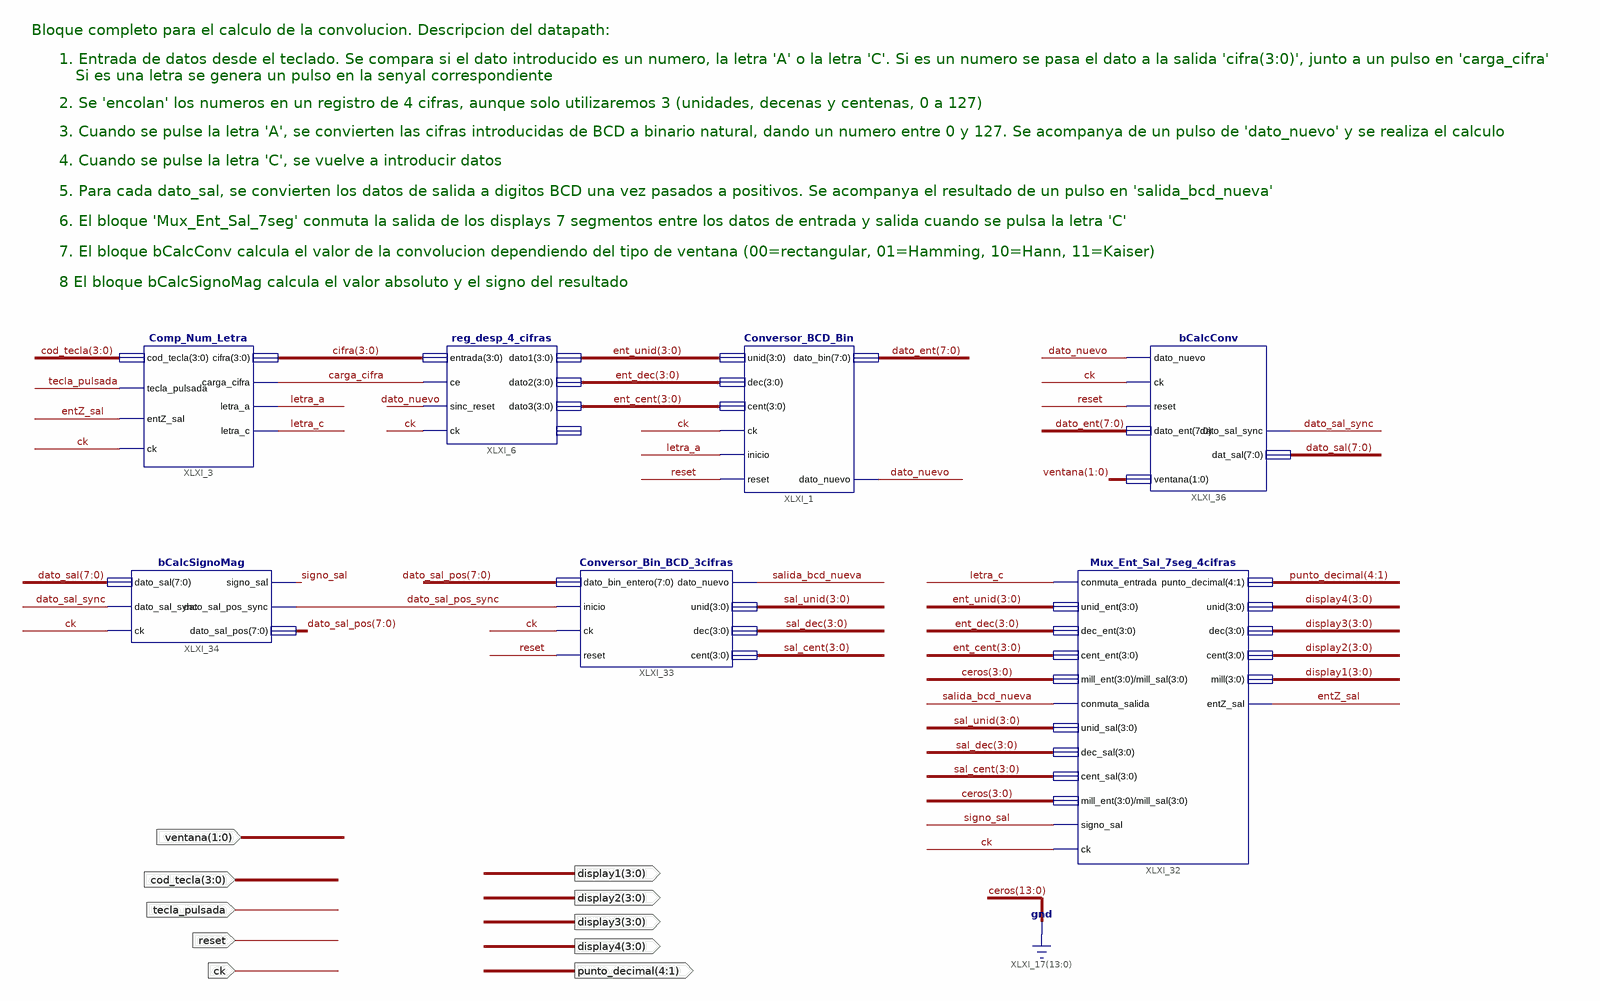
[diagram p0: schematic sheet 1]
// Xilinx ISE schematic bloque_convol.sch (spartan6) as structural Verilog: 7 symbols, 10 ports
module bloque_convol (
  input  ck,
  input  [3:0] cod_tecla,
  input  tecla_pulsada,
  input  reset,
  input  [1:0] ventana,
  output [4:1] punto_decimal,
  output [3:0] display1,
  output [3:0] display2,
  output [3:0] display3,
  output [3:0] display4
);

  wire carga_cifra, dato_nuevo, dato_sal_pos_sync, dato_sal_sync, entZ_sal, letra_a, letra_c,
       salida_bcd_nueva, signo_sal;
  wire [3:0] cifra, ent_cent, ent_dec, ent_unid, sal_cent, sal_dec, sal_unid;
  wire [7:0] dato_ent, dato_sal, dato_sal_pos;

  Comp_Num_Letra XLXI_3 (
    .tecla_pulsada(tecla_pulsada), .ck(ck), .cod_tecla(cod_tecla), .entZ_sal(entZ_sal),
    .carga_cifra(carga_cifra), .letra_a(letra_a), .letra_c(letra_c), .cifra(cifra));
  reg_desp_4_cifras XLXI_6 (
    .ck(ck), .ce(carga_cifra), .entrada(cifra), .sinc_reset(dato_nuevo), .dato1(ent_unid), .dato2(ent_dec),
    .dato3(ent_cent));  // open: dato4
  Conversor_BCD_Bin XLXI_1 (
    .unid(ent_unid), .dec(ent_dec), .cent(ent_cent), .ck(ck), .inicio(letra_a), .reset(reset),
    .dato_nuevo(dato_nuevo), .dato_bin(dato_ent));
  Mux_Ent_Sal_7seg_4cifras XLXI_32 (
    .conmuta_salida(salida_bcd_nueva), .cent_ent(ent_cent), .dec_ent(ent_dec), .conmuta_entrada(letra_c),
    .ck(ck), .unid_ent(ent_unid), .mill_ent(4'b0000), .unid_sal(sal_unid), .dec_sal(sal_dec),
    .cent_sal(sal_cent), .mill_sal(4'b0000), .signo_sal(signo_sal), .punto_decimal(punto_decimal),
    .entZ_sal(entZ_sal), .unid(display4), .dec(display3), .cent(display2), .mill(display1));
  Conversor_Bin_BCD_3cifras XLXI_33 (
    .ck(ck), .dato_bin_entero(dato_sal_pos), .inicio(dato_sal_pos_sync), .reset(reset),
    .dato_nuevo(salida_bcd_nueva), .unid(sal_unid), .dec(sal_dec), .cent(sal_cent));
  bCalcSignoMag XLXI_34 (
    .dato_sal(dato_sal), .dato_sal_sync(dato_sal_sync), .ck(ck), .signo_sal(signo_sal),
    .dato_sal_pos_sync(dato_sal_pos_sync), .dato_sal_pos(dato_sal_pos));
  bCalcConv XLXI_36 (
    .dato_nuevo(dato_nuevo), .ck(ck), .reset(reset), .dato_ent(dato_ent), .ventana(ventana),
    .dat_sal(dato_sal), .dato_sal_sync(dato_sal_sync));

  // Notes on the sheet:
  //   Bloque completo para el calculo de la convolucion. Descripcion del datapath:
  //   1. Entrada de datos desde el teclado. Se compara si el dato introducido es un numero, la letra 'A' o la letra 'C'. Si es un numero se pasa el dato a la salida 'cifra(3:0)', junto a un pulso en 'carga_cifra'
  //   Si es una letra se genera un pulso en la senyal correspondiente
  //   2. Se 'encolan' los numeros en un registro de 4 cifras, aunque solo utilizaremos 3 (unidades, decenas y centenas, 0 a 127)
  //   3. Cuando se pulse la letra 'A', se convierten las cifras introducidas de BCD a binario natural, dando un numero entre 0 y 127. Se acompanya de un pulso de 'dato_nuevo' y se realiza el calculo
  //   4. Cuando se pulse la letra 'C', se vuelve a introducir datos
  //   5. Para cada dato_sal, se convierten los datos de salida a digitos BCD una vez pasados a positivos. Se acompanya el resultado de un pulso en 'salida_bcd_nueva'
  //   6. El bloque 'Mux_Ent_Sal_7seg' conmuta la salida de los displays 7 segmentos entre los datos de entrada y salida cuando se pulsa la letra 'C'
  //   7. El bloque bCalcConv calcula el valor de la convolucion dependiendo del tipo de ventana (00=rectangular, 01=Hamming, 10=Hann, 11=Kaiser)
  //   8 El bloque bCalcSignoMag calcula el valor absoluto y el signo del resultado
endmodule
